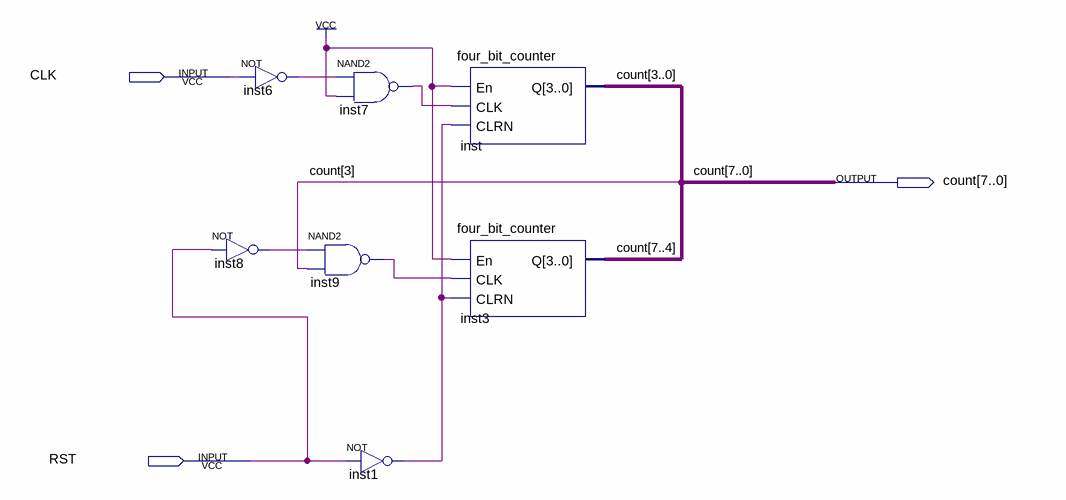
[diagram p0: schematic sheet]
// Quartus schematic counter.bdf as structural Verilog: 7 symbols, 3 pins
module counter (
  input  CLK,
  input  RST,
  output [7:0] count
);

  wire inst1_out, inst6_out, inst7_out, inst8_out, inst9_out;

  not inst6 (inst6_out, CLK);
  not inst8 (inst8_out, RST);
  nand inst7 (inst7_out, inst6_out, 1'b1);
  nand inst9 (inst9_out, inst8_out, count[3]);
  not inst1 (inst1_out, RST);
  four_bit_counter inst (.En(1'b1), .CLK(inst7_out), .CLRN(inst1_out), .Q(count[3:0]));
  four_bit_counter inst3 (.En(1'b1), .CLK(inst9_out), .CLRN(inst1_out), .Q(count[7:4]));
endmodule
